# EAGLE schematic ltc2344-16 (EAGLE 9.5.1)
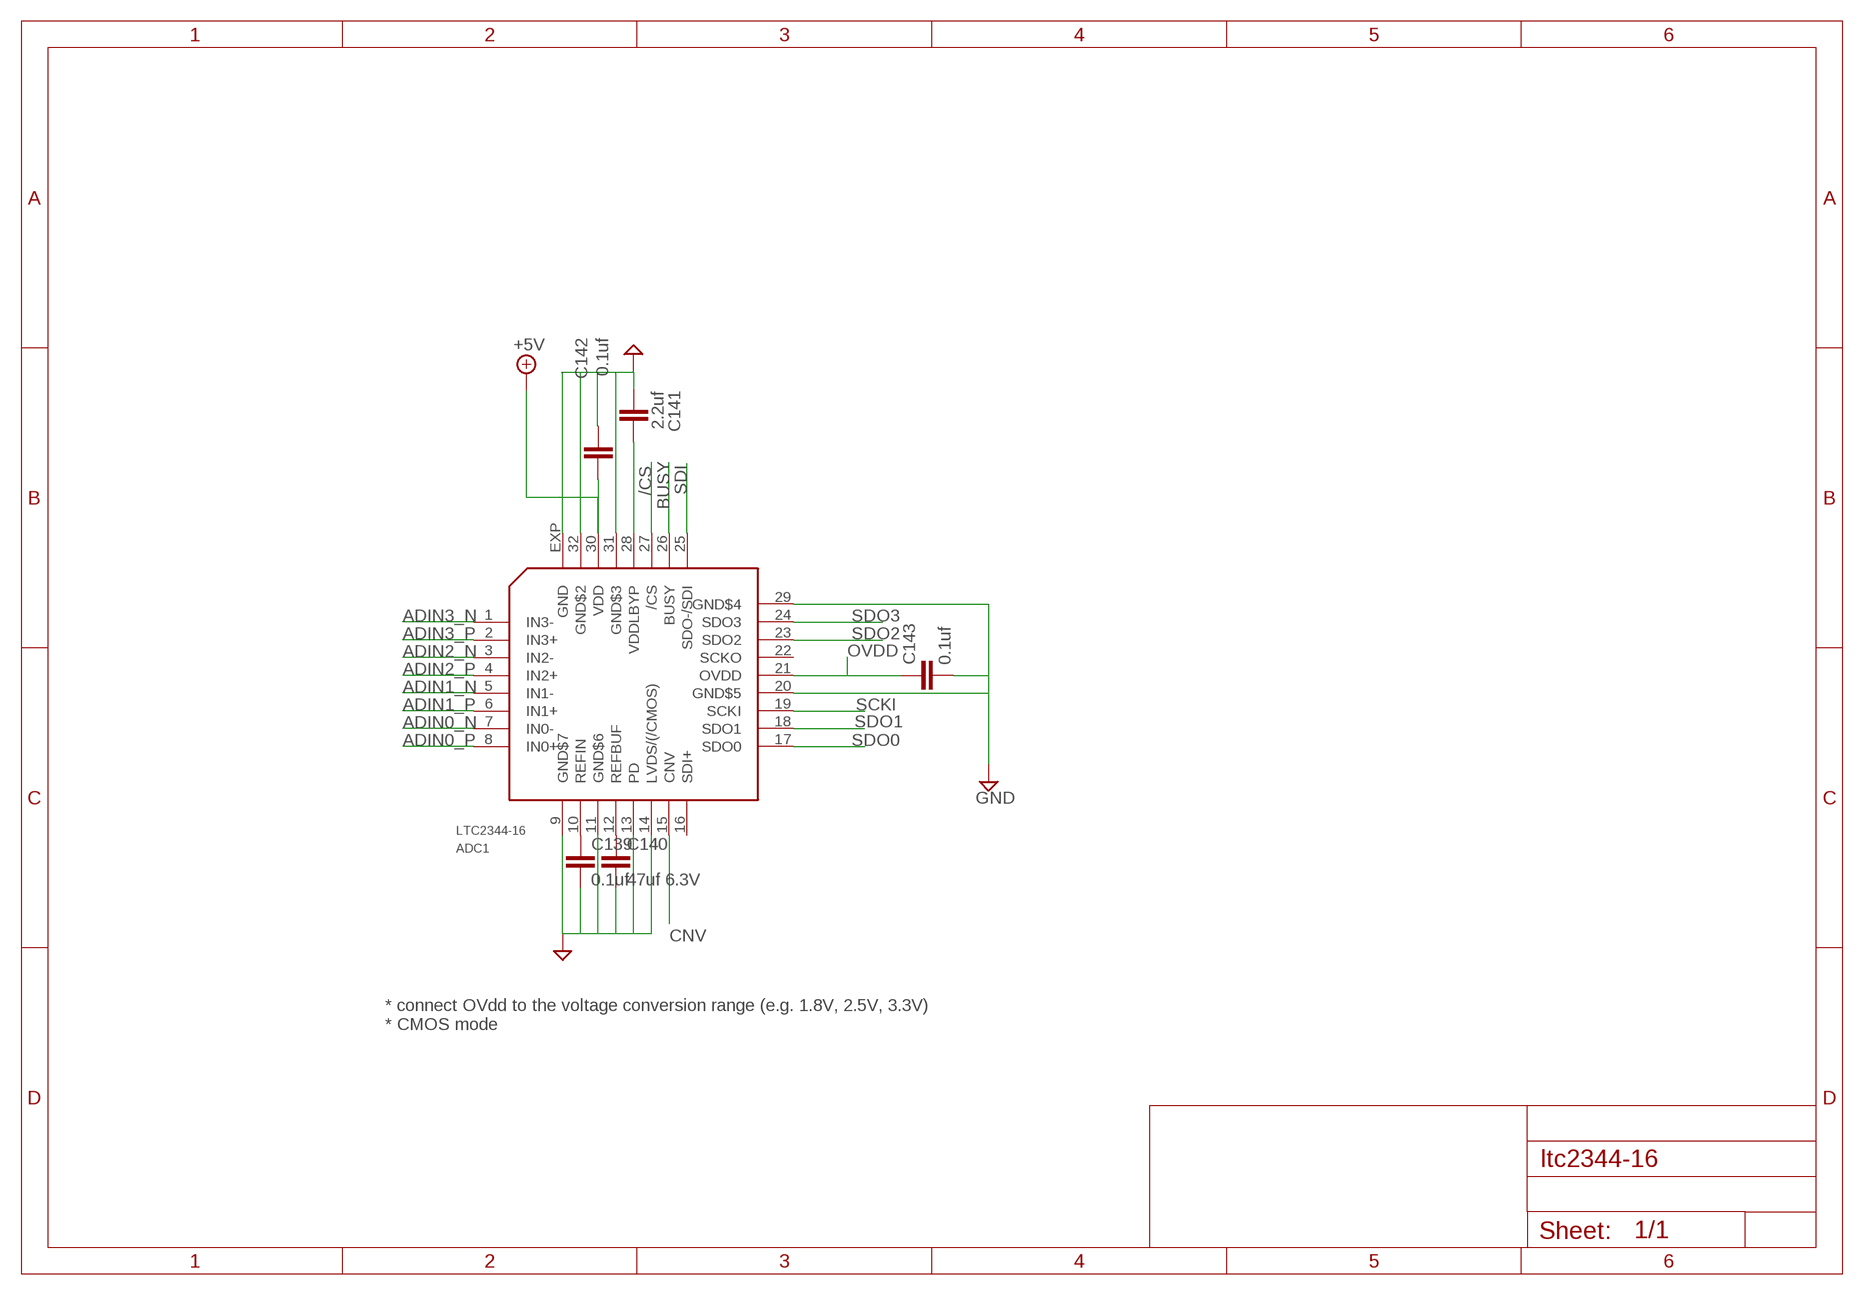
[diagram p0: schematic, sheet 1]

## Parts
ADC1  LTC2344-16  [QFN32]
C139  0.1uf  C-EUC0402  [C0402]
C140  47uf 6.3V  C-EUC0603  [C0603]
C141  2.2uf  C-EUC0402  [C0402]
C142  0.1uf  C-EUC0402  [C0402]
C143  0.1uf  C-EUC0402  [C0402]

## Nets
+5V: ADC1.30(VDD) C142.1
/CS: ADC1.27(/CS)
ADIN0_N: ADC1.7(IN0-)
ADIN0_P: ADC1.8(IN0+)
ADIN1_N: ADC1.5(IN1-)
ADIN1_P: ADC1.6(IN1+)
ADIN2_N: ADC1.3(IN2-)
ADIN2_P: ADC1.4(IN2+)
ADIN3_N: ADC1.1(IN3-)
ADIN3_P: ADC1.2(IN3+)
BUSY: ADC1.26(BUSY)
CNV: ADC1.15(CNV)
GND [power]: ADC1.9(GND$7) ADC1.11(GND$6) ADC1.13(PD) ADC1.14(LVDS/(/CMOS)) ADC1.20(GND$5) ADC1.29(GND$4) ADC1.31(GND$3) ADC1.32(GND$2) ADC1.EXP(GND) C139.2 C140.2 C141.2 C142.2 C143.2
N$1: ADC1.21(OVDD) C143.1
N$81: ADC1.10(REFIN) C139.1
N$82: ADC1.12(REFBUF) C140.1
N$83: ADC1.28(VDDLBYP) C141.1
SCKI: ADC1.19(SCKI)
SDI: ADC1.25(SDO-/SDI)
SDO0: ADC1.17(SDO0)
SDO1: ADC1.18(SDO1)
SDO2: ADC1.23(SDO2)
SDO3: ADC1.24(SDO3)
Unconnected: ADC1.16(SDI+) ADC1.22(SCKO)

## Notes on the sheet
- * connect OVdd to the voltage conversion range (e.g. 1.8V, 2.5V, 3.3V)
  * CMOS mode

## Library data of the parts
ADC1 = wouter:LTC2344-16
C139-C143 = rcl:C-EU: CAPACITOR, European symbol; SPICEPREFIX: C